# Altium schematic sheet 2.4GBT.SchDoc: Flyer_2.4GBT
size A4
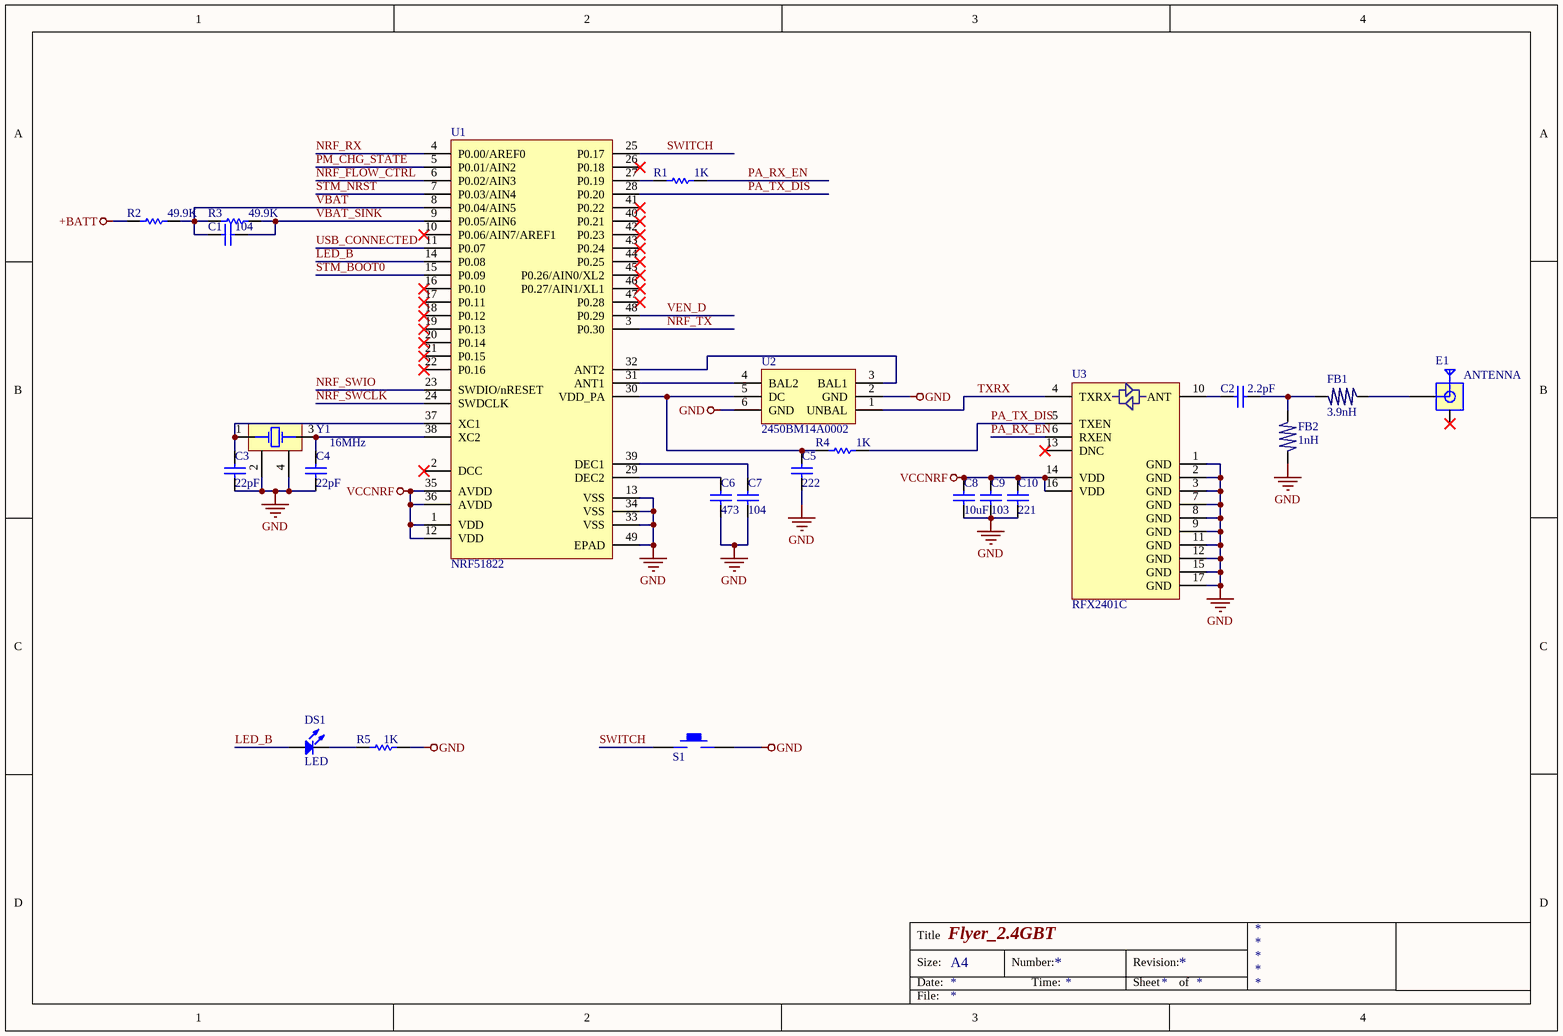
[diagram p0: 2.4GBT.SchDoc]

## Parts
C1  104  [C0603]
C2  2.2pF  [C0603]
C3  22pF  [C0603]
C4  22pF  [C0603]
C5  222  [C0603]
C6  473  [C0603]
C7  104  [C0603]
C8  10uF  [C0603]
C9  103  [C0603]
C10  221  [C0603]
DS1  LED  [LED-2-1206]
E1  ANTENNA  [AN3216]
FB1  3.9nH  [L0603]
FB2  1nH  [L0603]
R1  1K  [R0603]
R2  49.9K  [R0603]
R3  49.9K  [R0603]
R4  1K  [R0603]
R5  1K  [R0603]
S1  KEY  [KEY-3X6X3.5-C]  (value not drawn)
U1  NRF51822  [QFN-48]
U2  2450BM14A0002  [0603-6]
U3  RFX2401C  [QFN-16]
Y1  16MHz  [X-TSX-3225]

## Nets
+BATT: R2.1
GND: C3.1 C4.1 C5.1 C6.1 C7.1 C8.1 C9.1 C10.1 FB2.2 R5.1 S1.2 U1.13(VSS) U1.33(VSS) U1.34(VSS) U1.49(EPAD) U2.2(GND) U2.6(GND) U3.1(GND) U3.2(GND) U3.3(GND) U3.7(GND) U3.8(GND) U3.9(GND) U3.11(GND) U3.12(GND) U3.15(GND) U3.17(GND) Y1.2 Y1.4
VCCNRF: C8.2 C9.2 C10.2 U1.1(VDD) U1.12(VDD) U1.35(AVDD) U1.36(AVDD) U3.14(VDD) U3.16(VDD)
LED_B: DS1.1(A) U1.14(P0.08)
NRF_FLOW_CTRL: U1.6(P0.02/AIN3)
NRF_RX: U1.4(P0.00/AREF0)
NRF_SWCLK: U1.24(SWDCLK)
NRF_SWIO: U1.23(SWDIO/nRESET)
NRF_TX: U1.3(P0.30)
PA_RX_EN: R1.2 U3.6(RXEN)
PA_TX_DIS: R4.2 U1.28(P0.20) U3.5(TXEN)
PM_CHG_STATE: U1.5(P0.01/AIN2)
STM_BOOT0: U1.15(P0.09)
STM_NRST: U1.7(P0.03/AIN4)
SWITCH: S1.1 U1.25(P0.17)
TXRX: U2.1(UNBAL) U3.4(TXRX)
USB_CONNECTED: U1.11(P0.07)
VBAT: C1.2 R2.2 R3.1 U1.8(P0.04/AIN5)
VBAT_SINK: C1.1 R3.2 U1.9(P0.05/AIN6)
VEN_D: U1.48(P0.29)
NetC2_1: C2.1 FB1.2 FB2.1
NetC2_2: C2.2 U3.10(ANT)
NetC3_2: C3.2 U1.37(XC1) Y1.1
NetC4_2: C4.2 U1.38(XC2) Y1.3
NetC5_2: C5.2 R4.1 U1.30(VDD_PA) U2.5(DC)
NetC6_2: C6.2 U1.29(DEC2)
NetC7_2: C7.2 U1.39(DEC1)
NetDS1_2: DS1.2(K) R5.2
NetE1_1: E1.1 FB1.1
NetR1_1: R1.1 U1.27(P0.19)
NetU1_31: U1.31(ANT1) U2.4(BAL2)
NetU1_32: U1.32(ANT2) U2.3(BAL1)

Not connected (* = marked no-connect by the designer): E1 2*; U1 2(DCC)* 10(P0.06/AIN7/AREF1)* 16(P0.10)* 17(P0.11)* 18(P0.12)* 19(P0.13)* 20(P0.14)* 21(P0.15)* 22(P0.16)* 26(P0.18)* 40(P0.21)* 41(P0.22)* 42(P0.23)* 43(P0.24)* 44(P0.25)* 45(P0.26/AIN0/XL2)* 46(P0.27/AIN1/XL1)* 47(P0.28)*; U3 13(DNC)*

## Notes on the sheet
- Title
- Size:
- Date:
- A4
- Number:
- Time:
- Revision:
- Sheet
- of
- File:

## Library data of the parts
C1-C10 = C0603: 电容; Published: 8-Jun-2000; LatestRevisionDate: 17-Jul-2002; LatestRevisionNote: Re-released for DXP Platform.; PackageReference: RAD-0.3; Publisher: Altium Limited; PackageDescription: Radial Cap, Thru-Hole; 2 Leads; 0.3 in Pin Spacing; UnitPrice: 0.02
DS1 = LED: Typical RED, GREEN, YELLOW, AMBER GaAs LED; Published: 8-Jun-2000; LatestRevisionDate: 17-Jul-2002; LatestRevisionNote: Re-released for DXP Platform.; PackageDocument: Feb-2002; PackageReference: 3.2X1.6X1.1; Publisher: Altium Limited; UnitPrice: 0.05
FB1 FB2 = L-Beads: 磁珠
R1-R5 = RES0603: 电阻; Published: 8-Jun-2000; LatestRevisionDate: 17-Jul-2002; LatestRevisionNote: Re-released for DXP Platform.; PackageReference: AXIAL-0.3; Publisher: Altium Limited; PackageDescription: Axial Device, Thru-Hole; 2 Leads; 0.3 in Pin Spacing
S1 = KEY: 普通轻触按钮
U2 = BALUN
Y1 = XTAL_1: Crystal Oscillator; Published: 8-Jun-2000; LatestRevisionDate: 17-Jul-2002; LatestRevisionNote: Re-released for DXP Platform.; Publisher: Altium Limited
E1 = ANTENNA: UnitPrice: 1.3